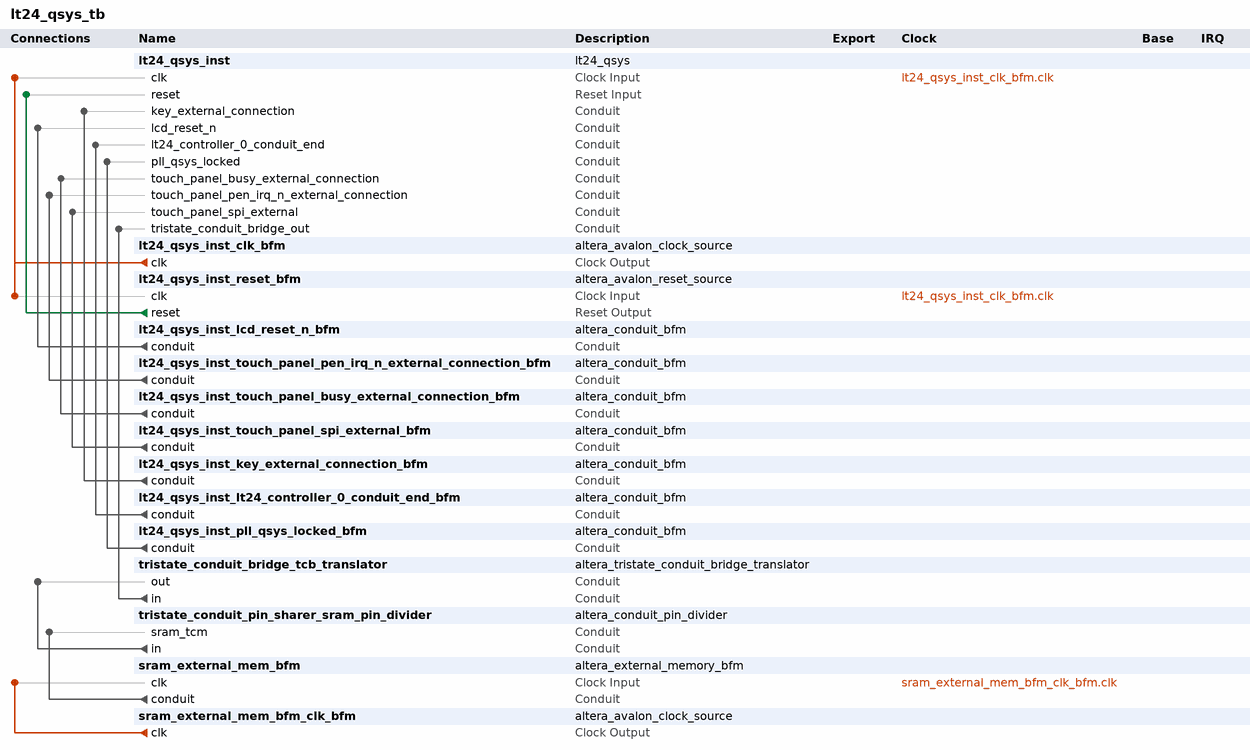
[diagram p0: system contents]
# Platform Designer (Qsys) system lt24_qsys_tb, Cyclone V 5CGXFC5C6F27C7
# Parameters at their usual value, and those the tool derives, are not listed.
package require -exact qsys 13.1
create_system lt24_qsys_tb
set_project_property DEVICE_FAMILY {Cyclone V}
set_project_property DEVICE 5CGXFC5C6F27C7

add_instance lt24_qsys_inst lt24_qsys 1.0

add_instance lt24_qsys_inst_clk_bfm altera_avalon_clock_source 13.1

add_instance lt24_qsys_inst_reset_bfm altera_avalon_reset_source 13.1
set_instance_parameter_value lt24_qsys_inst_reset_bfm ASSERT_HIGH_RESET 0
set_instance_parameter_value lt24_qsys_inst_reset_bfm INITIAL_RESET_CYCLES 50

add_instance lt24_qsys_inst_lcd_reset_n_bfm altera_conduit_bfm 13.1
set_instance_parameter_value lt24_qsys_inst_lcd_reset_n_bfm CLOCKED_SIGNAL false
set_instance_parameter_value lt24_qsys_inst_lcd_reset_n_bfm ENABLE_RESET false
set_instance_parameter_value lt24_qsys_inst_lcd_reset_n_bfm SIGNAL_WIDTHS 1
set_instance_parameter_value lt24_qsys_inst_lcd_reset_n_bfm SIGNAL_DIRECTIONS input

add_instance lt24_qsys_inst_touch_panel_pen_irq_n_external_connection_bfm altera_conduit_bfm 13.1
set_instance_parameter_value lt24_qsys_inst_touch_panel_pen_irq_n_external_connection_bfm CLOCKED_SIGNAL false
set_instance_parameter_value lt24_qsys_inst_touch_panel_pen_irq_n_external_connection_bfm ENABLE_RESET false
set_instance_parameter_value lt24_qsys_inst_touch_panel_pen_irq_n_external_connection_bfm SIGNAL_WIDTHS 1
set_instance_parameter_value lt24_qsys_inst_touch_panel_pen_irq_n_external_connection_bfm SIGNAL_DIRECTIONS output

add_instance lt24_qsys_inst_touch_panel_busy_external_connection_bfm altera_conduit_bfm 13.1
set_instance_parameter_value lt24_qsys_inst_touch_panel_busy_external_connection_bfm CLOCKED_SIGNAL false
set_instance_parameter_value lt24_qsys_inst_touch_panel_busy_external_connection_bfm ENABLE_RESET false
set_instance_parameter_value lt24_qsys_inst_touch_panel_busy_external_connection_bfm SIGNAL_WIDTHS 1
set_instance_parameter_value lt24_qsys_inst_touch_panel_busy_external_connection_bfm SIGNAL_DIRECTIONS output

add_instance lt24_qsys_inst_touch_panel_spi_external_bfm altera_conduit_bfm 13.1
set_instance_parameter_value lt24_qsys_inst_touch_panel_spi_external_bfm CLOCKED_SIGNAL false
set_instance_parameter_value lt24_qsys_inst_touch_panel_spi_external_bfm ENABLE_RESET false
set_instance_parameter_value lt24_qsys_inst_touch_panel_spi_external_bfm SIGNAL_ROLES MISO,MOSI,SCLK,SS_n
set_instance_parameter_value lt24_qsys_inst_touch_panel_spi_external_bfm SIGNAL_WIDTHS 1,1,1,1
set_instance_parameter_value lt24_qsys_inst_touch_panel_spi_external_bfm SIGNAL_DIRECTIONS output,input,input,input

add_instance lt24_qsys_inst_key_external_connection_bfm altera_conduit_bfm 13.1
set_instance_parameter_value lt24_qsys_inst_key_external_connection_bfm CLOCKED_SIGNAL false
set_instance_parameter_value lt24_qsys_inst_key_external_connection_bfm ENABLE_RESET false
set_instance_parameter_value lt24_qsys_inst_key_external_connection_bfm SIGNAL_WIDTHS 4
set_instance_parameter_value lt24_qsys_inst_key_external_connection_bfm SIGNAL_DIRECTIONS output

add_instance lt24_qsys_inst_lt24_controller_0_conduit_end_bfm altera_conduit_bfm 13.1
set_instance_parameter_value lt24_qsys_inst_lt24_controller_0_conduit_end_bfm CLOCKED_SIGNAL false
set_instance_parameter_value lt24_qsys_inst_lt24_controller_0_conduit_end_bfm ENABLE_RESET false
set_instance_parameter_value lt24_qsys_inst_lt24_controller_0_conduit_end_bfm SIGNAL_ROLES cs,rs,rd,wr,data
set_instance_parameter_value lt24_qsys_inst_lt24_controller_0_conduit_end_bfm SIGNAL_WIDTHS 1,1,1,1,16
set_instance_parameter_value lt24_qsys_inst_lt24_controller_0_conduit_end_bfm SIGNAL_DIRECTIONS input,input,input,input,input

add_instance lt24_qsys_inst_pll_qsys_locked_bfm altera_conduit_bfm 13.1
set_instance_parameter_value lt24_qsys_inst_pll_qsys_locked_bfm CLOCKED_SIGNAL false
set_instance_parameter_value lt24_qsys_inst_pll_qsys_locked_bfm ENABLE_RESET false
set_instance_parameter_value lt24_qsys_inst_pll_qsys_locked_bfm SIGNAL_WIDTHS 1
set_instance_parameter_value lt24_qsys_inst_pll_qsys_locked_bfm SIGNAL_DIRECTIONS input

add_instance tristate_conduit_bridge_tcb_translator altera_tristate_conduit_bridge_translator 13.1
set_instance_parameter_value tristate_conduit_bridge_tcb_translator CHAIN_LENGTH 4
set_instance_parameter_value tristate_conduit_bridge_tcb_translator MODULE_ORIGIN_LIST tristate_conduit_pin_sharer_sram.tcm,tristate_conduit_pin_sharer_sram.tcm,tristate_conduit_pin_sharer_sram.tcm,tristate_conduit_pin_sharer_sram.tcm,tristate_conduit_pin_sharer_sram.tcm,tristate_conduit_pin_sharer_sram.tcm
set_instance_parameter_value tristate_conduit_bridge_tcb_translator SIGNAL_ORIGIN_LIST sram_tcm_data_out,sram_tcm_address_out,sram_tcm_outputenable_n_out,sram_tcm_chipselect_n_out,sram_tcm_byteenable_n_out,sram_tcm_write_n_out
set_instance_parameter_value tristate_conduit_bridge_tcb_translator SIGNAL_ORIGIN_TYPE Bidirectional,Output,Output,Output,Output,Output
set_instance_parameter_value tristate_conduit_bridge_tcb_translator SIGNAL_ORIGIN_WIDTH 16,19,1,1,2,1

add_instance tristate_conduit_pin_sharer_sram_pin_divider altera_conduit_pin_divider 13.1
set_instance_parameter_value tristate_conduit_pin_sharer_sram_pin_divider CHAIN_LENGTH 4
set_instance_parameter_value tristate_conduit_pin_sharer_sram_pin_divider MODULE_ORIGIN_LIST sram.tcm,sram.tcm,sram.tcm,sram.tcm,sram.tcm,sram.tcm
set_instance_parameter_value tristate_conduit_pin_sharer_sram_pin_divider SIGNAL_ORIGIN_LIST sram_tcm_address_out,sram_tcm_outputenable_n_out,sram_tcm_byteenable_n_out,sram_tcm_write_n_out,sram_tcm_data_out,sram_tcm_chipselect_n_out
set_instance_parameter_value tristate_conduit_pin_sharer_sram_pin_divider SIGNAL_ORIGIN_TYPE Output,Output,Output,Output,Bidirectional,Output
set_instance_parameter_value tristate_conduit_pin_sharer_sram_pin_divider SIGNAL_ORIGIN_WIDTH 19,1,2,1,16,1

add_instance sram_external_mem_bfm altera_external_memory_bfm 13.1
set_instance_parameter_value sram_external_mem_bfm USE_BYTEENABLE 1
set_instance_parameter_value sram_external_mem_bfm USE_CHIPSELECT 1
set_instance_parameter_value sram_external_mem_bfm USE_WRITE 1
set_instance_parameter_value sram_external_mem_bfm USE_READ 0
set_instance_parameter_value sram_external_mem_bfm USE_OUTPUTENABLE 1
set_instance_parameter_value sram_external_mem_bfm USE_BEGINTRANSFER 0
set_instance_parameter_value sram_external_mem_bfm USE_RESET 0
set_instance_parameter_value sram_external_mem_bfm ACTIVE_LOW_BYTEENABLE 1
set_instance_parameter_value sram_external_mem_bfm ACTIVE_LOW_CHIPSELECT 1
set_instance_parameter_value sram_external_mem_bfm ACTIVE_LOW_WRITE 1
set_instance_parameter_value sram_external_mem_bfm ACTIVE_LOW_READ 0
set_instance_parameter_value sram_external_mem_bfm ACTIVE_LOW_OUTPUTENABLE 1
set_instance_parameter_value sram_external_mem_bfm ACTIVE_LOW_BEGINTRANSFER 0
set_instance_parameter_value sram_external_mem_bfm ACTIVE_LOW_RESET 0
set_instance_parameter_value sram_external_mem_bfm SIGNAL_ADDRESS_ROLES tcm_address_out
set_instance_parameter_value sram_external_mem_bfm SIGNAL_DATA_ROLES tcm_data_out
set_instance_parameter_value sram_external_mem_bfm SIGNAL_WRITE_ROLES tcm_write_n_out
set_instance_parameter_value sram_external_mem_bfm SIGNAL_READ_ROLES tcm_read_out
set_instance_parameter_value sram_external_mem_bfm SIGNAL_BYTEENABLE_ROLES tcm_byteenable_n_out
set_instance_parameter_value sram_external_mem_bfm SIGNAL_CHIPSELECT_ROLES tcm_chipselect_n_out
set_instance_parameter_value sram_external_mem_bfm SIGNAL_OUTPUTENABLE_ROLES tcm_outputenable_n_out
set_instance_parameter_value sram_external_mem_bfm SIGNAL_BEGINTRANSFER_ROLES tcm_begintransfer_out
set_instance_parameter_value sram_external_mem_bfm SIGNAL_RESET_ROLES tcm_reset_out
set_instance_parameter_value sram_external_mem_bfm CDT_ADDRESS_W 19
set_instance_parameter_value sram_external_mem_bfm CDT_SYMBOL_W 8
set_instance_parameter_value sram_external_mem_bfm CDT_NUMSYMBOLS 2
set_instance_parameter_value sram_external_mem_bfm INIT_FILE altera_external_memory_bfm.hex
set_instance_parameter_value sram_external_mem_bfm CDT_READ_LATENCY 0
set_instance_parameter_value sram_external_mem_bfm VHDL_ID 0

add_instance sram_external_mem_bfm_clk_bfm altera_avalon_clock_source 13.1
set_instance_parameter_value sram_external_mem_bfm_clk_bfm CLOCK_RATE 100000000

# connections
add_connection lt24_qsys_inst_clk_bfm.clk lt24_qsys_inst.clk clock
add_connection lt24_qsys_inst_clk_bfm.clk lt24_qsys_inst_reset_bfm.clk clock
add_connection sram_external_mem_bfm_clk_bfm.clk sram_external_mem_bfm.clk clock
add_connection lt24_qsys_inst_reset_bfm.reset lt24_qsys_inst.reset reset
add_connection lt24_qsys_inst_key_external_connection_bfm.conduit lt24_qsys_inst.key_external_connection conduit
add_connection lt24_qsys_inst_lcd_reset_n_bfm.conduit lt24_qsys_inst.lcd_reset_n conduit
add_connection lt24_qsys_inst_lt24_controller_0_conduit_end_bfm.conduit lt24_qsys_inst.lt24_controller_0_conduit_end conduit
add_connection lt24_qsys_inst_pll_qsys_locked_bfm.conduit lt24_qsys_inst.pll_qsys_locked conduit
add_connection lt24_qsys_inst_touch_panel_busy_external_connection_bfm.conduit lt24_qsys_inst.touch_panel_busy_external_connection conduit
add_connection lt24_qsys_inst_touch_panel_pen_irq_n_external_connection_bfm.conduit lt24_qsys_inst.touch_panel_pen_irq_n_external_connection conduit
add_connection lt24_qsys_inst_touch_panel_spi_external_bfm.conduit lt24_qsys_inst.touch_panel_spi_external conduit
add_connection sram_external_mem_bfm.conduit tristate_conduit_pin_sharer_sram_pin_divider.sram_tcm conduit
add_connection tristate_conduit_bridge_tcb_translator.in lt24_qsys_inst.tristate_conduit_bridge_out conduit
add_connection tristate_conduit_pin_sharer_sram_pin_divider.in tristate_conduit_bridge_tcb_translator.out conduit

set_interconnect_requirement {$system} qsys_mm.clockCrossingAdapter HANDSHAKE
set_interconnect_requirement {$system} qsys_mm.maxAdditionalLatency 1
set_interconnect_requirement {$system} qsys_mm.insertDefaultSlave false

save_system lt24_qsys_tb.qsys
